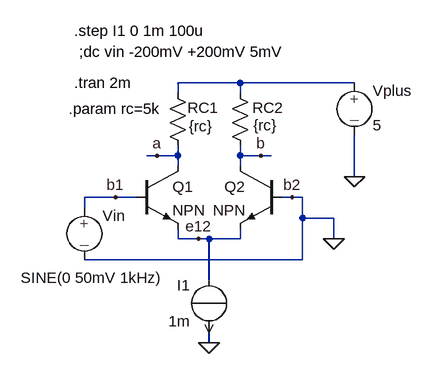
[diagram p0: schematic diff_1-verst.asc]
diff_1-verst.asc, the LTspice schematic file:
Version 4
SHEET 1 880 680
WIRE 304 -32 208 -32
WIRE 480 -32 304 -32
WIRE 208 -16 208 -32
WIRE 304 -16 304 -32
WIRE 176 80 160 80
WIRE 208 80 208 64
WIRE 208 80 176 80
WIRE 304 80 304 64
WIRE 336 80 304 80
WIRE 352 80 336 80
WIRE 208 96 208 80
WIRE 304 96 304 80
WIRE 480 112 480 48
WIRE 112 144 64 144
WIRE 144 144 112 144
WIRE 384 144 368 144
WIRE 400 144 384 144
WIRE 64 160 64 144
WIRE 400 176 400 144
WIRE 448 176 400 176
WIRE 208 208 208 192
WIRE 240 208 208 208
WIRE 256 208 240 208
WIRE 304 208 304 192
WIRE 304 208 256 208
WIRE 448 208 448 176
WIRE 400 240 400 176
WIRE 400 240 64 240
WIRE 256 272 256 208
WIRE 256 368 256 352
FLAG 480 112 0
FLAG 256 368 0
FLAG 112 144 b1
FLAG 384 144 b2
FLAG 240 208 e12
FLAG 448 208 0
FLAG 336 80 b
FLAG 176 80 a
SYMBOL source-I 256 352 R180
WINDOW 0 29 73 Left 2
WINDOW 3 29 17 Left 2
SYMATTR InstName I1
SYMATTR Value 1m
SYMBOL EIT_Semiconductors\\npn 144 96 R0
SYMATTR InstName Q1
SYMBOL EIT_Semiconductors\\npn 368 96 M0
SYMATTR InstName Q2
SYMBOL source-V 64 144 R0
WINDOW 3 -98 124 Left 2
WINDOW 123 0 0 Left 2
WINDOW 39 0 0 Left 2
SYMATTR Value SINE(0 50mV 1kHz)
SYMATTR InstName Vin
SYMBOL source-V 480 -48 R0
SYMATTR InstName Vplus
SYMATTR Value 5
SYMBOL res 192 -32 R0
WINDOW 0 31 38 Left 2
WINDOW 3 33 67 Left 2
SYMATTR InstName RC1
SYMATTR Value {rc}
SYMBOL res 288 -32 R0
WINDOW 0 35 38 Left 2
WINDOW 3 36 65 Left 2
SYMATTR InstName RC2
SYMATTR Value {rc}
TEXT 56 -80 Left 2 !;dc vin -200mV +200mV 5mV
TEXT 40 8 Left 2 !.param rc=5k
TEXT 48 -32 Left 2 !.tran 2m
TEXT 48 -112 Left 2 !.step I1 0 1m 100u

The netlist it stands for:
* diff_1-verst.asc
I1 e12 0 1m
Q1 a b1 e12 0 NPN
Q2 b 0 e12 0 NPN
Vin b1 0 SINE(0 50mV 1kHz)
Vplus N001 0 5
RC1 N001 a {rc}
RC2 N001 b {rc}
.model NPN NPN
.model PNP PNP
.lib standard.bjt
;dc vin -200mV +200mV 5mV
.param rc=5k
.tran 2m
.step I1 0 1m 100u
.backanno
.end